# Altium project PFC_Stage.PrjPcb (part 3 of 3)

## Sheet Edge_Card_Interface.SchDoc
size A2; DocumentNumber: 9; SheetNumber: 9; SheetTotal: 10
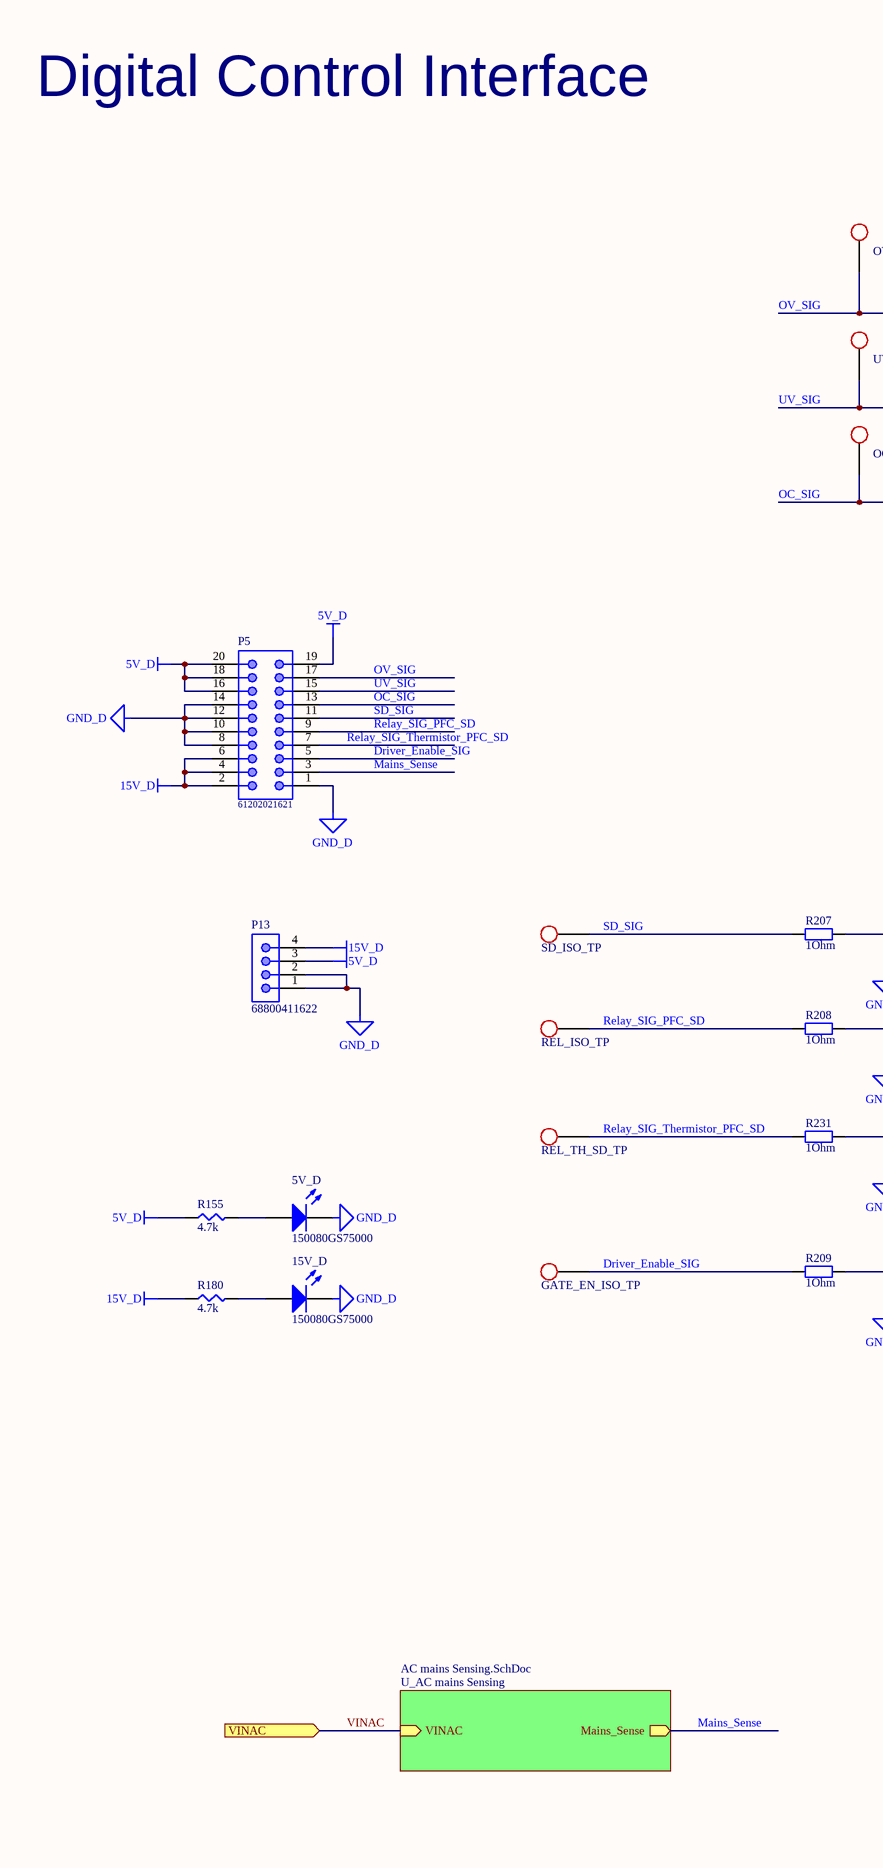
[diagram p11: Edge_Card_Interface.SchDoc, left]
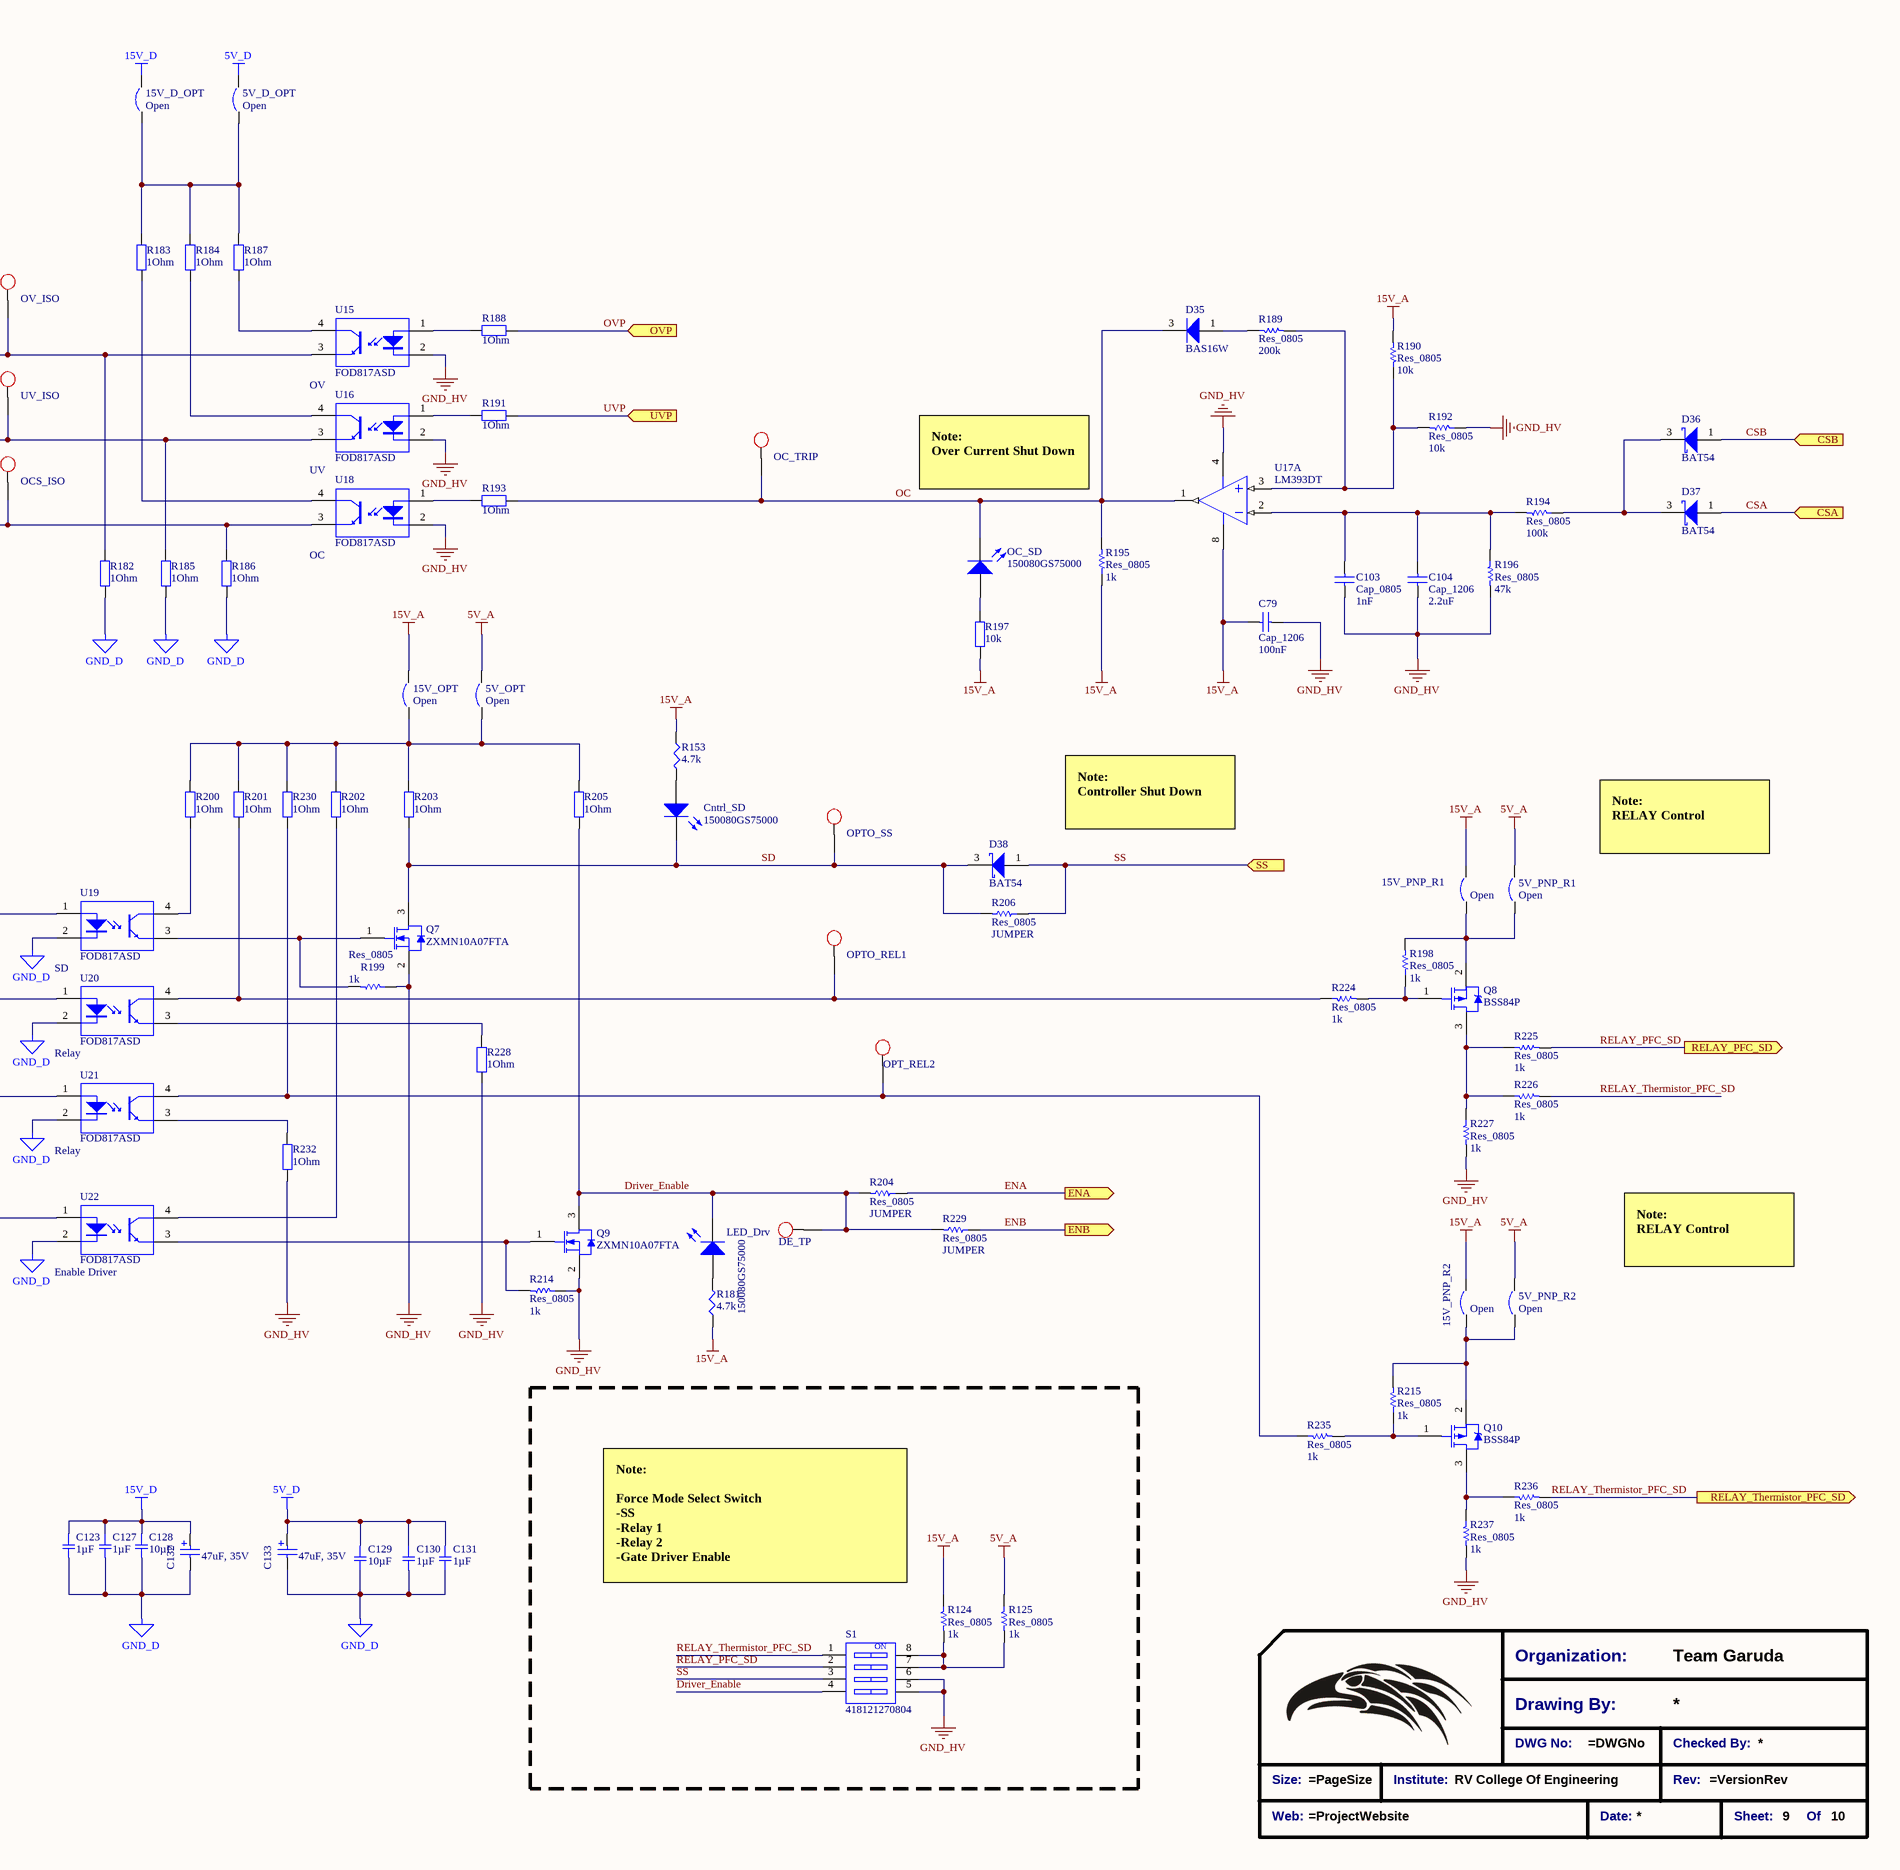
[diagram p12: Edge_Card_Interface.SchDoc, right]

### Parts
(Parts that share a designator on the sheet are numbered #1, #2 ... from top to bottom, then left to right.)
5V_D  150080GS75000  [0805_A]
5V_D_OPT  Open  [Solder Bridge - HP]  (no BOM)
5V_OPT  Open  [Solder Bridge - HP]  (no BOM)
5V_PNP_R1  Open  [Solder Bridge - HP - SQ]  (no BOM)
5V_PNP_R2  Open  [Solder Bridge - HP - SQ]  (no BOM)
15V_D  150080GS75000  [0805_A]
15V_D_OPT  Open  [Solder Bridge - HP]  (no BOM)
15V_OPT  Open  [Solder Bridge - HP]  (no BOM)
15V_PNP_R1  Open  [Solder Bridge - HP - SQ]  (no BOM)
15V_PNP_R2  Open  [Solder Bridge - HP - SQ]  (no BOM)
*?#4  Title_Block  (value not drawn)  (graphical)
C79  Cap_1206  value 100nF  [SMD-1206C]
C103  Cap_0805  Size: 1nF  [SMD-0805C]
C104  Cap_1206  value 2.2uF  [SMD-1206C]
C123  1µF  [SMD-0805C]
C127  1µF  [SMD-0805C]
C128  10µF  [SMD-1206C]
C129  10µF  [SMD-1206C]
C130  1µF  [SMD-0805C]
C131  1µF  [SMD-0805C]
C132  47uF, 35V  [WCAP-ASLU_6.3x7.7]
C133  47uF, 35V  [WCAP-ASLU_6.3x7.7]
Cntrl_SD  150080GS75000  [0805_A]
D35  BAS16W  [SOT95P278X110-3N]
D36  BAT54  [SOT95P278X110-3N]
D37  BAT54  [SOT95P278X110-3N]
D38  BAT54  [SOT95P278X110-3N]
DE_TP  Test Point  [Test_point_SMD]  (value not drawn)  (no BOM)
GATE_EN_ISO_TP  Test Point  [Test_point_SMD]  (value not drawn)  (no BOM)
LED_Drv  150080GS75000  [0805_A]
OC_SD  150080GS75000  [0805_A]
OC_TRIP  Test Point  [Test_point_SMD]  (value not drawn)  (no BOM)
OCS_ISO  Test Point  [Test_point_SMD]  (value not drawn)  (no BOM)
OPT_REL2  Test Point  [Test_point_SMD]  (value not drawn)  (no BOM)
OPTO_REL1  Test Point  [Test_point_SMD]  (value not drawn)  (no BOM)
OPTO_SS  Test Point  [Test_point_SMD]  (value not drawn)  (no BOM)
OV_ISO  Test Point  [Test_point_SMD]  (value not drawn)  (no BOM)
P5  61202021621  [61202021621]
P13  68800411622  [68800411622]
Q7  ZXMN10A07FTA  [DIOD-SOT23-3_D_V]
Q8  BSS84P  [SOT95P278X110-3N]
Q9  ZXMN10A07FTA  [DIOD-SOT23-3_D_V]
Q10  BSS84P  [SOT95P278X110-3N]
R124  Res_0805  value 1k  [WRIS-KSKE_0805_H=0.6mm]
R125  Res_0805  value 1k  [WRIS-KSKE_0805_H=0.6mm]
R153#2  4.7k  [SMD-0805-RES]
R155#2  4.7k  [SMD-0805-RES]
R180  4.7k  [SMD-0805-RES]
R181  4.7k  [SMD-0805-RES]
R182  1Ohm  [WRIS-KSKE_0805_H=0.6mm]
R183  1Ohm  [WRIS-KSKE_0805_H=0.6mm]
R184  1Ohm  [WRIS-KSKE_0805_H=0.6mm]
R185  1Ohm  [WRIS-KSKE_0805_H=0.6mm]
R186  1Ohm  [WRIS-KSKE_0805_H=0.6mm]
R187  1Ohm  [WRIS-KSKE_0805_H=0.6mm]
R188  1Ohm  [WRIS-KSKE_0805_H=0.6mm]
R189  Res_0805  value 200k  [WRIS-KSKE_0805_H=0.6mm]
R190  Res_0805  value 10k  [WRIS-KSKE_0805_H=0.6mm]
R191  1Ohm  [WRIS-KSKE_0805_H=0.6mm]
R192  Res_0805  value 10k  [WRIS-KSKE_0805_H=0.6mm]
R193  1Ohm  [WRIS-KSKE_0805_H=0.6mm]
R194  Res_0805  value 100k  [WRIS-KSKE_0805_H=0.6mm]
R195  Res_0805  value 1k  [WRIS-KSKE_0805_H=0.6mm]
R196  Res_0805  value 47k  [WRIS-KSKE_0805_H=0.6mm]
R197  10k  [WRIS-KSKE_0805_H=0.6mm]
R198  Res_0805  value 1k  [WRIS-KSKE_0805_H=0.6mm]
R199  Res_0805  value 1k  [WRIS-KSKE_0805_H=0.6mm]
R200  1Ohm  [WRIS-KSKE_0805_H=0.6mm]
R201  1Ohm  [WRIS-KSKE_0805_H=0.6mm]
R202  1Ohm  [WRIS-KSKE_0805_H=0.6mm]
R203  1Ohm  [WRIS-KSKE_0805_H=0.6mm]
R204  Res_0805  value JUMPER  [WRIS-KSKE_0805_H=0.6mm]
R205  1Ohm  [WRIS-KSKE_0805_H=0.6mm]
R206  Res_0805  value JUMPER  [WRIS-KSKE_0805_H=0.6mm]
R207  1Ohm  [WRIS-KSKE_0805_H=0.6mm]
R208  1Ohm  [WRIS-KSKE_0805_H=0.6mm]
R209  1Ohm  [WRIS-KSKE_0805_H=0.6mm]
R214#2  Res_0805  value 1k  [WRIS-KSKE_0805_H=0.6mm]
R215#2  Res_0805  value 1k  [WRIS-KSKE_0805_H=0.6mm]
R224  Res_0805  value 1k  [WRIS-KSKE_0805_H=0.6mm]
R225  Res_0805  value 1k  [WRIS-KSKE_0805_H=0.6mm]
R226  Res_0805  value 1k  [WRIS-KSKE_0805_H=0.6mm]
R227  Res_0805  value 1k  [WRIS-KSKE_0805_H=0.6mm]
R228  1Ohm  [WRIS-KSKE_0805_H=0.6mm]
R229  Res_0805  value JUMPER  [WRIS-KSKE_0805_H=0.6mm]
R230  1Ohm  [WRIS-KSKE_0805_H=0.6mm]
R231  1Ohm  [WRIS-KSKE_0805_H=0.6mm]
R232  1Ohm  [WRIS-KSKE_0805_H=0.6mm]
R235  Res_0805  value 1k  [WRIS-KSKE_0805_H=0.6mm]
R236  Res_0805  value 1k  [WRIS-KSKE_0805_H=0.6mm]
R237  Res_0805  value 1k  [WRIS-KSKE_0805_H=0.6mm]
REL_ISO_TP  Test Point  [Test_point_SMD]  (value not drawn)  (no BOM)
REL_TH_SD_TP  Test Point  [Test_point_SMD]  (value not drawn)  (no BOM)
S1  418121270804  [418121270804]
SD_ISO_TP  Test Point  [Test_point_SMD]  (value not drawn)  (no BOM)
U15  FOD817ASD  Signal: OV  [FAIR-MDIP-4_V]
U16  FOD817ASD  Signal: UV  [FAIR-MDIP-4_V]
U17  LM393DT  [SOIC127P570X175_HS-9N - No Thermal]  (part A of 2)
U18  FOD817ASD  Signal: OC  [FAIR-MDIP-4_V]
U19  FOD817ASD  Signal: SD  [FAIR-MDIP-4_V]
U20  FOD817ASD  Signal: Relay  [FAIR-MDIP-4_V]
U21  FOD817ASD  Signal: Relay  [FAIR-MDIP-4_V]
U22  FOD817ASD  Signal: Enable Driver  [FAIR-MDIP-4_V]
UV_ISO  Test Point  [Test_point_SMD]  (value not drawn)  (no BOM)

### Sub-sheets
U_AC mains Sensing = AC mains Sensing.SchDoc: VINAC (in), Mains_Sense (out)

### Ports
CSA (in), CSB (in), ENA (out), ENB (out), OVP (in), RELAY_PFC_SD (out), RELAY_Thermistor_PFC_SD (out), SS (in), UVP (in), VINAC (in)

### Nets
5V_A: 5V_OPT.2 5V_PNP_R1.2 5V_PNP_R2.2 R125.1
5V_D: 5V_D_OPT.2 C129.1 C130.1 C131.1 C133.2(P) P5.16 P5.18 P5.19 P5.20 P13.3 R155#2.1
15V_A: 15V_OPT.2 15V_PNP_R1.2 15V_PNP_R2.2 C79.1 R124.1 R153#2.1 R181.1 R190.2 R195.1 R197.1 U17.8(VCC+)
15V_D: 15V_D_OPT.2 C123.1 C127.1 C128.1 C132.2(P) P5.2 P5.4 P5.6 P13.4 R180.1
GND_D: 5V_D.1(K) 15V_D.1(K) C123.2 C127.2 C128.2 C129.2 C130.2 C131.2 C132.1(N) C133.1(N) P5.1 P5.8 P5.10 P5.12 P5.14 P13.1 P13.2 R182.1 R185.1 R186.2 U19.2(CATHODE) U20.2(CATHODE) U21.2(CATHODE) U22.2(CATHODE)
GND_HV: C79.2 C103.1 C104.2 Q7.2(S) Q9.2(S) R192.1 R196.2 R199.1 R214#2.1 R227.2 R228.1 R232.1 R237.2 S1.5 S1.6 U15.2(CATHODE) U16.2(CATHODE) U17.4(VCC-) U18.2(CATHODE)
CSA: D37.1(A) ; port CSA
CSB: D36.1(A) ; port CSB
Driver_Enable: DE_TP.1 LED_Drv.1(K) Q9.3(D) R204.2 R205.1 R229.2 S1.4  [project net Driver_Enable_9]
Driver_Enable_SIG: GATE_EN_ISO_TP.1 P5.5 R209.2  [project net Driver_Enable_SIG_9]
ENA: R204.1 ; port ENA
ENB: R229.1 ; port ENB
Mains_Sense: P5.3 ; sheet U_AC mains Sensing/Mains_Sense
OC: D35.3(K) OC_SD.1(K) OC_TRIP.1 R193.1 R195.2 U17.1(OUT1)  [project net OC_9]
OC_SIG: OCS_ISO.1 P5.13 R186.1 U18.3(EMITTER)  [project net OC_SIG_9]
OV_SIG: OV_ISO.1 P5.17 R182.2 U15.3(EMITTER)  [project net OV_SIG_9]
OVP: R188.1 ; port OVP
RELAY_PFC_SD: R225.2 S1.2 ; port RELAY_PFC_SD
Relay_SIG_PFC_SD: P5.9 R208.2 REL_ISO_TP.1  [project net Relay_SIG_PFC_SD_9]
Relay_SIG_Thermistor_PFC_SD: P5.7 R231.2 REL_TH_SD_TP.1  [project net Relay_SIG_Thermistor_PFC_SD_9]
RELAY_Thermistor_PFC_SD: R226.2 R236.2 S1.1 ; port RELAY_Thermistor_PFC_SD
SD: Cntrl_SD.1(K) D38.3(K) OPTO_SS.1 Q7.3(D) R203.1 R206.2  [project net SD_9]
SD_SIG: P5.11 R207.2 SD_ISO_TP.1  [project net SD_SIG_9]
SS: D38.1(A) R206.1 S1.3 ; port SS
UV_SIG: P5.15 R185.2 U16.3(EMITTER) UV_ISO.1  [project net UV_SIG_9]
UVP: R191.1 ; port UVP
VINAC: port VINAC, sheet U_AC mains Sensing/VINAC
Net5V_D_2: 5V_D.2(A) R155#2.2
Net5V_D_OPT_1: 5V_D_OPT.1 15V_D_OPT.1 R183.2 R184.2 R187.1
Net5V_OPT_1: 5V_OPT.1 15V_OPT.1 R200.2 R201.2 R202.2 R203.2 R205.2 R230.2
Net5V_PNP_R1_1: 5V_PNP_R1.1 15V_PNP_R1.1 Q8.2(SOURCE) R198.2
Net5V_PNP_R2_1: 5V_PNP_R2.1 15V_PNP_R2.1 Q10.2(SOURCE) R215#2.2
Net15V_D_2: 15V_D.2(A) R180.2
NetC103_2: C103.2 C104.1 R194.2 R196.1 U17.2(IN1-)
NetCntrl_SD_2: Cntrl_SD.2(A) R153#2.2
NetD35_1: D35.1(A) R189.1
NetD36_3: D36.3(K) D37.3(K) R194.1
NetLED_Drv_2: LED_Drv.2(A) R181.2
NetOC_SD_2: OC_SD.2(A) R197.2
NetOPT_REL2_1: OPT_REL2.1 R230.1 R235.1 U21.4(COLLECTOR)
NetOPTO_REL1_1: OPTO_REL1.1 R201.1 R224.1 U20.4(COLLECTOR)
NetQ7_1: Q7.1(G) R199.2 U19.3(EMITTER)
NetQ8_1: Q8.1(GATE) R198.1 R224.2
NetQ8_3: Q8.3(DRAIN) R225.1 R226.1 R227.1
NetQ9_1: Q9.1(G) R214#2.2 U22.3(EMITTER)
NetQ10_1: Q10.1(GATE) R215#2.1 R235.2
NetQ10_3: Q10.3(DRAIN) R236.1 R237.1
NetR124_2: R124.2 R125.2 S1.7 S1.8
NetR183_1: R183.1 U18.4(COLLECTOR)
NetR184_1: R184.1 U16.4(COLLECTOR)
NetR187_2: R187.2 U15.4(COLLECTOR)
NetR188_2: R188.2 U15.1(ANODE)
NetR189_2: R189.2 R190.1 R192.2 U17.3(IN1+)
NetR191_2: R191.2 U16.1(ANODE)
NetR193_2: R193.2 U18.1(ANODE)
NetR200_1: R200.1 U19.4(COLLECTOR)
NetR202_1: R202.1 U22.4(COLLECTOR)
NetR207_1: R207.1 U19.1(ANODE)
NetR208_1: R208.1 U20.1(ANODE)
NetR209_1: R209.1 U22.1(ANODE)
NetR228_2: R228.2 U20.3(EMITTER)
NetR231_1: R231.1 U21.1(ANODE)
NetR232_2: R232.2 U21.3(EMITTER)

### Notes on the sheet
- Digital Control Interface
- Note:                                                                                  Over Current Shut Down
- Note:                                                                                Controller Shut Down
- Note:                                                                                 RELAY Control
- (near R124) Note:
  Force Mode Select Switch
  -SS
  -Relay 1
  -Relay 2
  -Gate Driver Enable
- (in symbol 418121270804) ON
- (in symbol Title_Block) Organization:; Team Garuda; Drawing By:; DWG No:; Checked By:; Size:; Institute:; RV College Of Engineering; Rev:; Web:; Date:; Sheet:; Of

### Library data of the parts
5V_D 15V_D Cntrl_SD LED_Drv OC_SD = 150080GS75000: SMD mono-color Chip LED, WL-SMCW, Green; PackageReference: 0805_A; Color: Green; PartNumber: 150080GS75000; ComponentLink1Description: Manufacturer URL; ComponentLink1URL: http://www.we-online.com; ComponentLink2Description: Datasheet; ComponentLink2URL: http://katalog.we-online.com/led/datasheet/150080GS75000.pdf
5V_D_OPT 5V_OPT 5V_PNP_R1 5V_PNP_R2 15V_D_OPT 15V_OPT 15V_PNP_R1 15V_PNP_R2 = Solder Bridge: Circuit Breaker; Published: 24-Mar-1999; Revision: July-2002: Re-released for DXP Platform.; Publisher: Altium Limited
*?#4 = Title_Block: Standard Title Block
C79 C104 = Cap: Capacitor; Published: 8-Jun-2000; LatestRevisionDate: 17-Jul-2002; LatestRevisionNote: Re-released for DXP Platform.; PackageReference: RAD-0.3; Publisher: Altium Limited; PackageDescription: Radial Cap, Thru-Hole; 2 Leads; 0.3 in Pin Spacing
C103 = Cap: Capacitor; Value: 100pF; Published: 8-Jun-2000; LatestRevisionDate: 17-Jul-2002; LatestRevisionNote: Re-released for DXP Platform.; PackageReference: RAD-0.3; Publisher: Altium Limited; PackageDescription: Radial Cap, Thru-Hole; 2 Leads; 0.3 in Pin Spacing
C123 C127 C130 C131 = GRM219R61H105KA73D: CAP CER 1UF 50V X5R 0805; Manufacturer: Murata Electronics North America; Factory Stock: 0; Unit Price (USD): 0.19; Minimum Quantity: 1; Tolerance: ±10%; Datasheets: http://www.murata.com/~/media/webrenewal/support/library/catalog/products/capacitor/mlcc/c02e.pdf; Image: //media.digikey.com/Renders/Murata%20Renders/0805%20(2012%20Metric)%20.85mm.jpg; Digi-Key Part Number: 490-10743-1-ND; Part Number: GRM219R61H105KA73D; Quantity Available: 3572; @ qty: 0; Packaging: Cut Tape (CT); Series: GRM; Part Status: Active; Value: 1µF; Voltage: 50V; Temperature Coefficient: X5R; Operating Temperature: -55°C ~ 85°C; Features: -; Ratings: -; Applications: General Purpose; Mounting Type: Surface Mount, MLCC; Package / Case: 0805 (2012 Metric); Size / Dimension: 0.079" L x 0.049" W (2.00mm x 1.25mm); Height - Seated (Max): -; Thickness (Max): 0.037" (0.95mm); Lead Spacing: -; Lead Style: -
C128 C129 = GCJ31CR71A106KA13L: CAP CER 10UF 10V X7R 1206; Manufacturer: Murata Electronics North America; Factory Stock: 0; Unit Price (USD): 0.71; Minimum Quantity: 1; Tolerance: ±10%; Datasheets: http://www.murata.com/~/media/webrenewal/support/library/catalog/products/capacitor/mlcc/c03e.ashx; Image: //media.digikey.com/Renders/Murata%20Renders/GR331BD72E473KW01L.jpg; Digi-Key Part Number: 490-5848-1-ND; Part Number: GCJ31CR71A106KA13L; Quantity Available: 33084; @ qty: 0; Packaging: Cut Tape (CT); Series: GCJ; Part Status: Active; Value: 10µF; Voltage: 10V; Temperature Coefficient: X7R; Operating Temperature: -55°C ~ 125°C; Features: Soft Termination; Ratings: AEC-Q200; Applications: Automotive, Boardflex Sensitive; Mounting Type: Surface Mount, MLCC; Package / Case: 1206 (3216 Metric); Size / Dimension: 0.126" L x 0.063" W (3.20mm x 1.60mm); Height - Seated (Max): -; Thickness (Max): 0.063" (1.60mm); Lead Spacing: -; Lead Style: -
C132 C133 = 865090545008: WCAP-ASLU Aluminium Electrolytic Capacitors, D6.3mm x L7.7mm, 47uF, +/-20%, 35VDC; Dissipation Factor: 14%; Leakage Current: 3.29uA; Endurance: 1000h; Technical Reference: ASBD077470M035DVCTCA000; Ripple Current max.: 75mA; ComponentLink1Description: Manufacturer; ComponentLink1URL: http://www.we-online.de; ComponentLink2Description: Datasheet; ComponentLink2URL: https://katalog.we-online.com/pbs/datasheet/865090545008.pdf; Mounting Technology: SMD; Operating Temperature: -40 to +85degC; Packaging: Tape and Reel; Part Number: 865090545008; Publisher: Wurth Elektronik; Capacitance: 47uF; Diameter: 6.3mm; Length: 7.7mm; Published Date: August 2019; Rated Voltage: 35VDC; Capacitance Tolerance: +/-20%
D35 = BAS16: Silicon Switching Diode, SOT323, Reel, Green; Manufacturer: Infineon; IR (max): 100Â nA; Configuration: Single; VBR (min): 85Â V; VR (max): 80Â V; trr (max): 4Â ns; Green: TRUE; VF (max): 1.25Â V; IF (max): 250Â mA; Mounting Technology: Surface Mount; PackageReference: SOT323; ComponentLink2URL: http://www.infineon.com/dgdl/bas16series.pdf?folderId=db3a30431400ef6801141b5844e103ea&fileId=db3a30431400ef6801141b93811b03ff; Halogen-free: TRUE; ComponentLink2Description: Datasheet; PartNumber: BAS16W; ComponentLink1Description: Manufacturer URL; ComponentLink3URL: http://www.infineon.com/dgdl/SOT323-Package_Overview.pdf?folderId=db3a30431936bc4b0119533e1dcb3c92&fileId=db3a30431936bc4b011953495f283cb1; ComponentLink1URL: http://www.infineon.com/; PackageDescription: 3-Pin Small Outline Transistor Package, 1.25 x 2 mm Body, 0.65 mm Pitch; ComponentLink3Description: Package Specification
D36-D38 = BAT54: Silicon Switching Diode, SOT323, Reel, Green; PartNumber: BAS16W; Manufacturer: Infineon; IR (max): 100Â nA; Configuration: Single; VBR (min): 85Â V; VR (max): 80Â V; trr (max): 4Â ns; Green: TRUE; VF (max): 1.25Â V; IF (max): 250Â mA; Mounting Technology: Surface Mount; PackageReference: SOT323; ComponentLink2URL: http://www.infineon.com/dgdl/bas16series.pdf?folderId=db3a30431400ef6801141b5844e103ea&fileId=db3a30431400ef6801141b93811b03ff; Halogen-free: TRUE; ComponentLink2Description: Datasheet; ComponentLink1Description: Manufacturer URL; ComponentLink3URL: http://www.infineon.com/dgdl/SOT323-Package_Overview.pdf?folderId=db3a30431936bc4b0119533e1dcb3c92&fileId=db3a30431936bc4b011953495f283cb1; ComponentLink1URL: http://www.infineon.com/; PackageDescription: 3-Pin Small Outline Transistor Package, 1.25 x 2 mm Body, 0.65 mm Pitch; ComponentLink3Description: Package Specification
DE_TP GATE_EN_ISO_TP OC_TRIP OCS_ISO OPT_REL2 OPTO_REL1 OPTO_SS OV_ISO REL_ISO_TP REL_TH_SD_TP SD_ISO_TP UV_ISO = Test Point: TP
P5 = 61202021621: Male Box Header WR-BHD, THT, Vertical, pitch 2.54 mm, 20 pins; Pitch: 2.54 mm; Working Voltage: 250 VAC; Withstanding Voltage: 500 VAC; Contact Resistance: 20 mOhm; Pin Number: 20; ComponentLink1Description: Manufacturer; ComponentLink1URL: http://www.we-online.de; ComponentLink2Description: Datasheet; ComponentLink2URL: https://katalog.we-online.de/em/datasheet/6120xx21621.pdf; Part Number: 61202021621; Published Date: August 2018; Publisher: Wurth Elektronik; Operating Temperature: -40 to 125 degC; Packaging: Tray; Gender: Male; Mounting Technology: THT; Orientation: Vertical
P13 = 68800411622: WR-WTB “J” Type THT Vertical Male Shrouded Header, pitch 2.5mm, 4p; Pin Number: 4; Contact Resistance: 20mOhm; Rated Current: 3A; Withstanding Voltage: 800VAC; Working Voltage: 250VAC; ComponentLink1Description: Manufacturer; ComponentLink1URL: http://www.we-online.de; ComponentLink2Description: Datasheet; ComponentLink2URL: https://www.we-online.com/catalog/datasheet/68800411622.pdf; Pitch: 2.5mm; Published Date: January 2020; Publisher: Wurth Elektronik; Mounting Technology: THT; Packaging: Bag; Operating Temperature: -25 to +85degC; Part Number: 68800411622; Gender: Male; Type: Vertical
Q7 Q9 = CMP-2000-07433-1: N-Channel Enhancement Mode MOSFET, 100 V, -55 to 150 degC, 3-Pin SOT23, RoHS, Tape and Reel; Manufacturer: Diodes Inc; Drain-to-Source Voltage [Vdss]: 100V; Qg Gate Charge: 2.9nC; Rated Power Dissipation: 625mW; Drain-Source On Resistance-Max: 0.7O; Package Description: 3-Pin Small Outline Transistor, Body 2.9 x 1.3 mm, Pitch 0.96 mm; Channel Type: N-Channel; Mounting Technology: SurfaceMount; Datasheet Version: Rev. 6-2, 08/2012; Manufacturer URL: http://www.diodes.com/; Datasheet URL: http://www.diodes.com/_files/datasheets/ZXMN10A07F.pdf; Package Reference: SOT23-3
Q8 Q10 = CMP-1099-00028-1: P-Channel SIPMOS Small-Signal-Transistor, -60 V VDS, -0.17 A ID, -55 to 150 degC, PG-SOT23, Reel, Green; Manufacturer: Infineon; VGS(th) (max): -2Â V; VGS(th) (min): -1Â V; VDS (max): -60Â V; Rth: 350Â K/W; Pto t (max): 0.36Â W; ID (max): -0.17Â A; IDpuls (max): -0.68Â A; RDS (on) (max) (@4.5V): 12,000Â mOhm; QG: 1Â nC; Green: TRUE; RDS (on) (max): 8,000Â mOhm; ComponentLink3URL: http://www.infineon.com/dgdl/SOT23-Package_Overview.pdf?folderId=db3a30431936bc4b0119532290053c66&fileId=db3a30431936bc4b0119533468123c85; ComponentLink3Description: Package Specification; Packing: Reel; PartNumber: BSS84P; ComponentLink2Description: Datasheet; Mounting Technology: Surface Mount; ComponentLink2URL: http://www.infineon.com/dgdl/BSS84P_Rev2.7%5B1%5D.pdf?folderId=db3a304314dca38901154a72e3951a65&fileId=db3a304330f68606013118ac7a9b4549; PackageReference: PG-SOT23; ComponentLink1URL: http://www.infineon.com/; PackageVersion: Apr-08; ComponentLink1Description: Manufacturer URL; PackageDescription: 3-Pin Small Outline Transistor Package, 2.9 x 1.3 mm Body, 0.95 mm Pitch; Halogen-free: TRUE; DatasheetVersion: Rev. 2.7
R124 R125 R189 R190 R192 R194-R196 R198 R199 R204 R206 R214#2 R215#2 R224-R227 R229 R235-R237 = Res1: Resistor; Published: 8-Jun-2000; LatestRevisionDate: 17-Jul-2002; LatestRevisionNote: Re-released for DXP Platform.; PackageReference: AXIAL-0.3; Publisher: Altium Limited; PackageDescription: Axial Device, Thru-Hole; 2 Leads; 0.3 in Pin Spacing
R153#2 R155#2 R180 R181 = ERJ-6ENF4701V: RES SMD 4.7K OHM 1% 1/8W 0805; Manufacturer: Panasonic Electronic Components; Factory Stock: 0; Unit Price (USD): 0.00729; @ qty: 1500; Minimum Quantity: 1; Power (Watts): 0.125W, 1/8W; Temperature Coefficient: ±100ppm/°C; Part Number: ERJ-6ENF4701V; Datasheets: http://industrial.panasonic.com/www-cgi/jvcr13pz.cgi?E+PZ+3+AOA0002+ERJ6ENF4701V+7+WW; Image: //media.digikey.com/Renders/Panasonic%20Renders/ERJ-0805%20Pkg.jpg; Digi-Key Part Number: P4.70KCCT-ND; Quantity Available: 312387; Packaging: Cut Tape (CT); Series: ERJ; Part Status: Active; Value: 4.7k; Tolerance: ±1%; Composition: Thick Film; Features: Automotive AEC-Q200; Operating Temperature: -55°C ~ 155°C; Package / Case: 0805 (2012 Metric); Supplier Device Package: 0805; Size / Dimension: 0.079" L x 0.049" W (2.00mm x 1.25mm); Height - Seated (Max): 0.028" (0.70mm); Number of Terminations: 2; Failure Rate: -
R182-R188 R191 R193 R200-R203 R205 R207-R209 R228 R230-R232 = 560050320011: WRIS-KSKE Thick Film Resistors, size 0805, 1Ohm, +/-1%, 0.33W; Rated Current: 0.57A; Temperature Coefficient of Resistance: +/-100ppm/degC; Technical Reference: KE08051R00F103KAATP0000; ComponentLink1Description: Manufacturer; ComponentLink1URL: http://www.we-online.de; ComponentLink2Description: Datasheet; ComponentLink2URL: https://katalog.we-online.com/pbs/datasheet/560050320011.pdf; Publisher: Wurth Elektronik; Rated Power: 0.33W; Resistance: 1Ohm; Mounting Technology: SMT; Height: 0.6mm; Part Number: 560050320011; Packaging: Tape and Reel; Published Date: September 2019; Size: 0805; Length: 2mm; Operating Temperature: -55 to +155degC; Resistance Tolerance: +/-1%; Width: 1.25mm
R197 = 560050320001: WRIS-KSKE Thick Film Resistors, size 0805, 0.1Ohm, +/-1%, 0.33W; Rated Current: 1.81A; Temperature Coefficient of Resistance: 250ppm/degC; Technical Reference: KE0805R100F103LAATP0000; ComponentLink1Description: Manufacturer; ComponentLink1URL: http://www.we-online.de; ComponentLink2Description: Datasheet; ComponentLink2URL: https://katalog.we-online.com/pbs/datasheet/560050320001.pdf; Publisher: Wurth Elektronik; Rated Power: 0.33W; Resistance: 0.1Ohm; Mounting Technology: SMT; Height: 0.6mm; Part Number: 560050320001; Packaging: Tape and Reel; Published Date: September 2019; Size: 0805; Length: 2mm; Operating Temperature: -55 to +155degC; Resistance Tolerance: +/-1%; Width: 1.25mm
S1 = 418121270804: WS-DISV Small Compact SMT Dip Switch, Raised Actuator, pitch 2.54mm, 4p; Operation Force: 600g; Pole Number: 4; Actuator Type: Raise Type; Circuit: SPST-NO; Rated Current Switching: 25mA; Rated Current Non-Switching: 100mA; Rated Voltage Non-Switching: 50VDC; Rated Voltage Switching: 24VDC; ComponentLink1Description: Manufacturer; ComponentLink1URL: http://www.we-online.de; ComponentLink2Description: Datasheet; ComponentLink2URL: https://katalog.we-online.com/em/datasheet/418121270804.pdf; Pitch: 2.54mm; Contact Material: Copper Alloy; Mounting Technology: SMT; Operating Temperature: -40 to +85degC; Contact Plating: Gold; Packaging: Tape and Reel; Part Number: 418121270804; Publisher: Wurth Elektronik; Published Date: September 2019
U15 U16 U18-U22 = CMP-2000-06279-1: Phototransistor Optocoupler, 4 us Rise, 3 us Fall, 5000 Vrms, -55 to 110 degC, 4-Pin MDIP, RoHS, Tape and Reel; Manufacturer: Fairchild Semiconductor; Maximum Input Current: 50mA; Maximum Forward Voltage: 1.4V; Maximum Reverse Voltage: 6V; Product Width: 7mm(Max); Input Type: DC; Maximum Current Transfer Ratio: 160%; Maximum Rise Time: 18us; Typical Rise Time: 4us; Typical Forward Voltage: 1.2V; Product Length: 5.1mm(Max); Package Version: 10/2014; Maximum Collector Emitter Saturation Voltage: 200mV; Number of Channels per Chip: 1; Product Height: 4mm(Max); Maximum Power Dissipation: 200mW; Typical Fall Time: 3us; Maximum Collector Emitter Voltage: 70V; Pin_Count: 4; Minimum Current Transfer Ratio: 80%; Output Device: Transistor; Manufacturer URL: https://www.fairchildsemi.com/; Family: FOD817; Supplier_Package: PDIPSMDBlack; Datasheet URL: https://www.fairchildsemi.com/datasheets/FO/FOD817.pdf; Package Description: 4-Pin Surface Mount Device, Body 6.5 x 4.6 mm, Pitch 2.54 mm; Mounting Technology: SurfaceMount; Package Reference: MDIP 4L; Maximum Operating Temperature: 110C; Mounting: SurfaceMount; Maximum Fall Time: 18us; Package URL: https://www.fairchildsemi.com/package-drawings/N0/N04C.pdf; Product Type: TransistorandPhotovoltaicOutputPhotoCouplers; Datasheet Version: Rev. 2.8, 11/2015; Minimum Operating Temperature: -55C; Maximum Collector Current: 50mA; Packaging: TapeandReel; Minimum Isolation Voltage: 5000Vrms; Output Type: DC
U17 = CMP-2000-06550-1: Low-Power, Dual-Voltage Comparator, 2 to 36 V, 0 to 70 degC, 8-Pin SOIC (SO), RoHS, Tape and Reel; Manufacturer: STMicroelectronics; Voltage - Supply, Single/Dual (±): 2V~36V,±1V~18V; Current - Input Bias (Max): 0.25µA@5V; Number of Elements: 2; Current - Output (Typ): 18mA@5V; Other Names: 497-1593-2; Voltage - Input Offset (Max): 5mV@30V; Output Type: CMOS,DTL,ECL,MOS,Open-Collector,TTL; EDA / CAD Models: DownloadfromAcceleratedDesigns; Other Related Documents: LM393ViewAllSpecificationsLM393ViewAllSpecifications; Online Catalog: Comparators-2elements; Current - Quiescent (Max): 2.5mA; Standard Package: 2,500; Manufacturer URL: http://www.st.com/; Package Description: 8-Pin Small Outline Integrated Circuit, Body 4.9 x 3.9 mm, Pitch 1.27 mm; Packaging: Tape&Reel(TR); Datasheet Version: Rev. 15, 02/2016; Category: IntegratedCircuits(ICs); Operating Temperature: 0°C~70°C; Mounting Type: SurfaceMount; Supplier Device Package: 8-SO; Datasheet URL: http://www.st.com/content/ccc/resource/technical/document/datasheet/group1/b4/cc/cf/13/18/28/44/f5/CD00000465/files/CD00000465.pdf/jcr:content/translations/en.CD00000465.pdf; Family: Linear-Comparators; Mounting Technology: SurfaceMount; Type: GeneralPurpose; Package Reference: SO-8; Package / Case: 8-SOIC(0.154",3.90mmWidth)

## Sheet AC mains Sensing.SchDoc
size A3
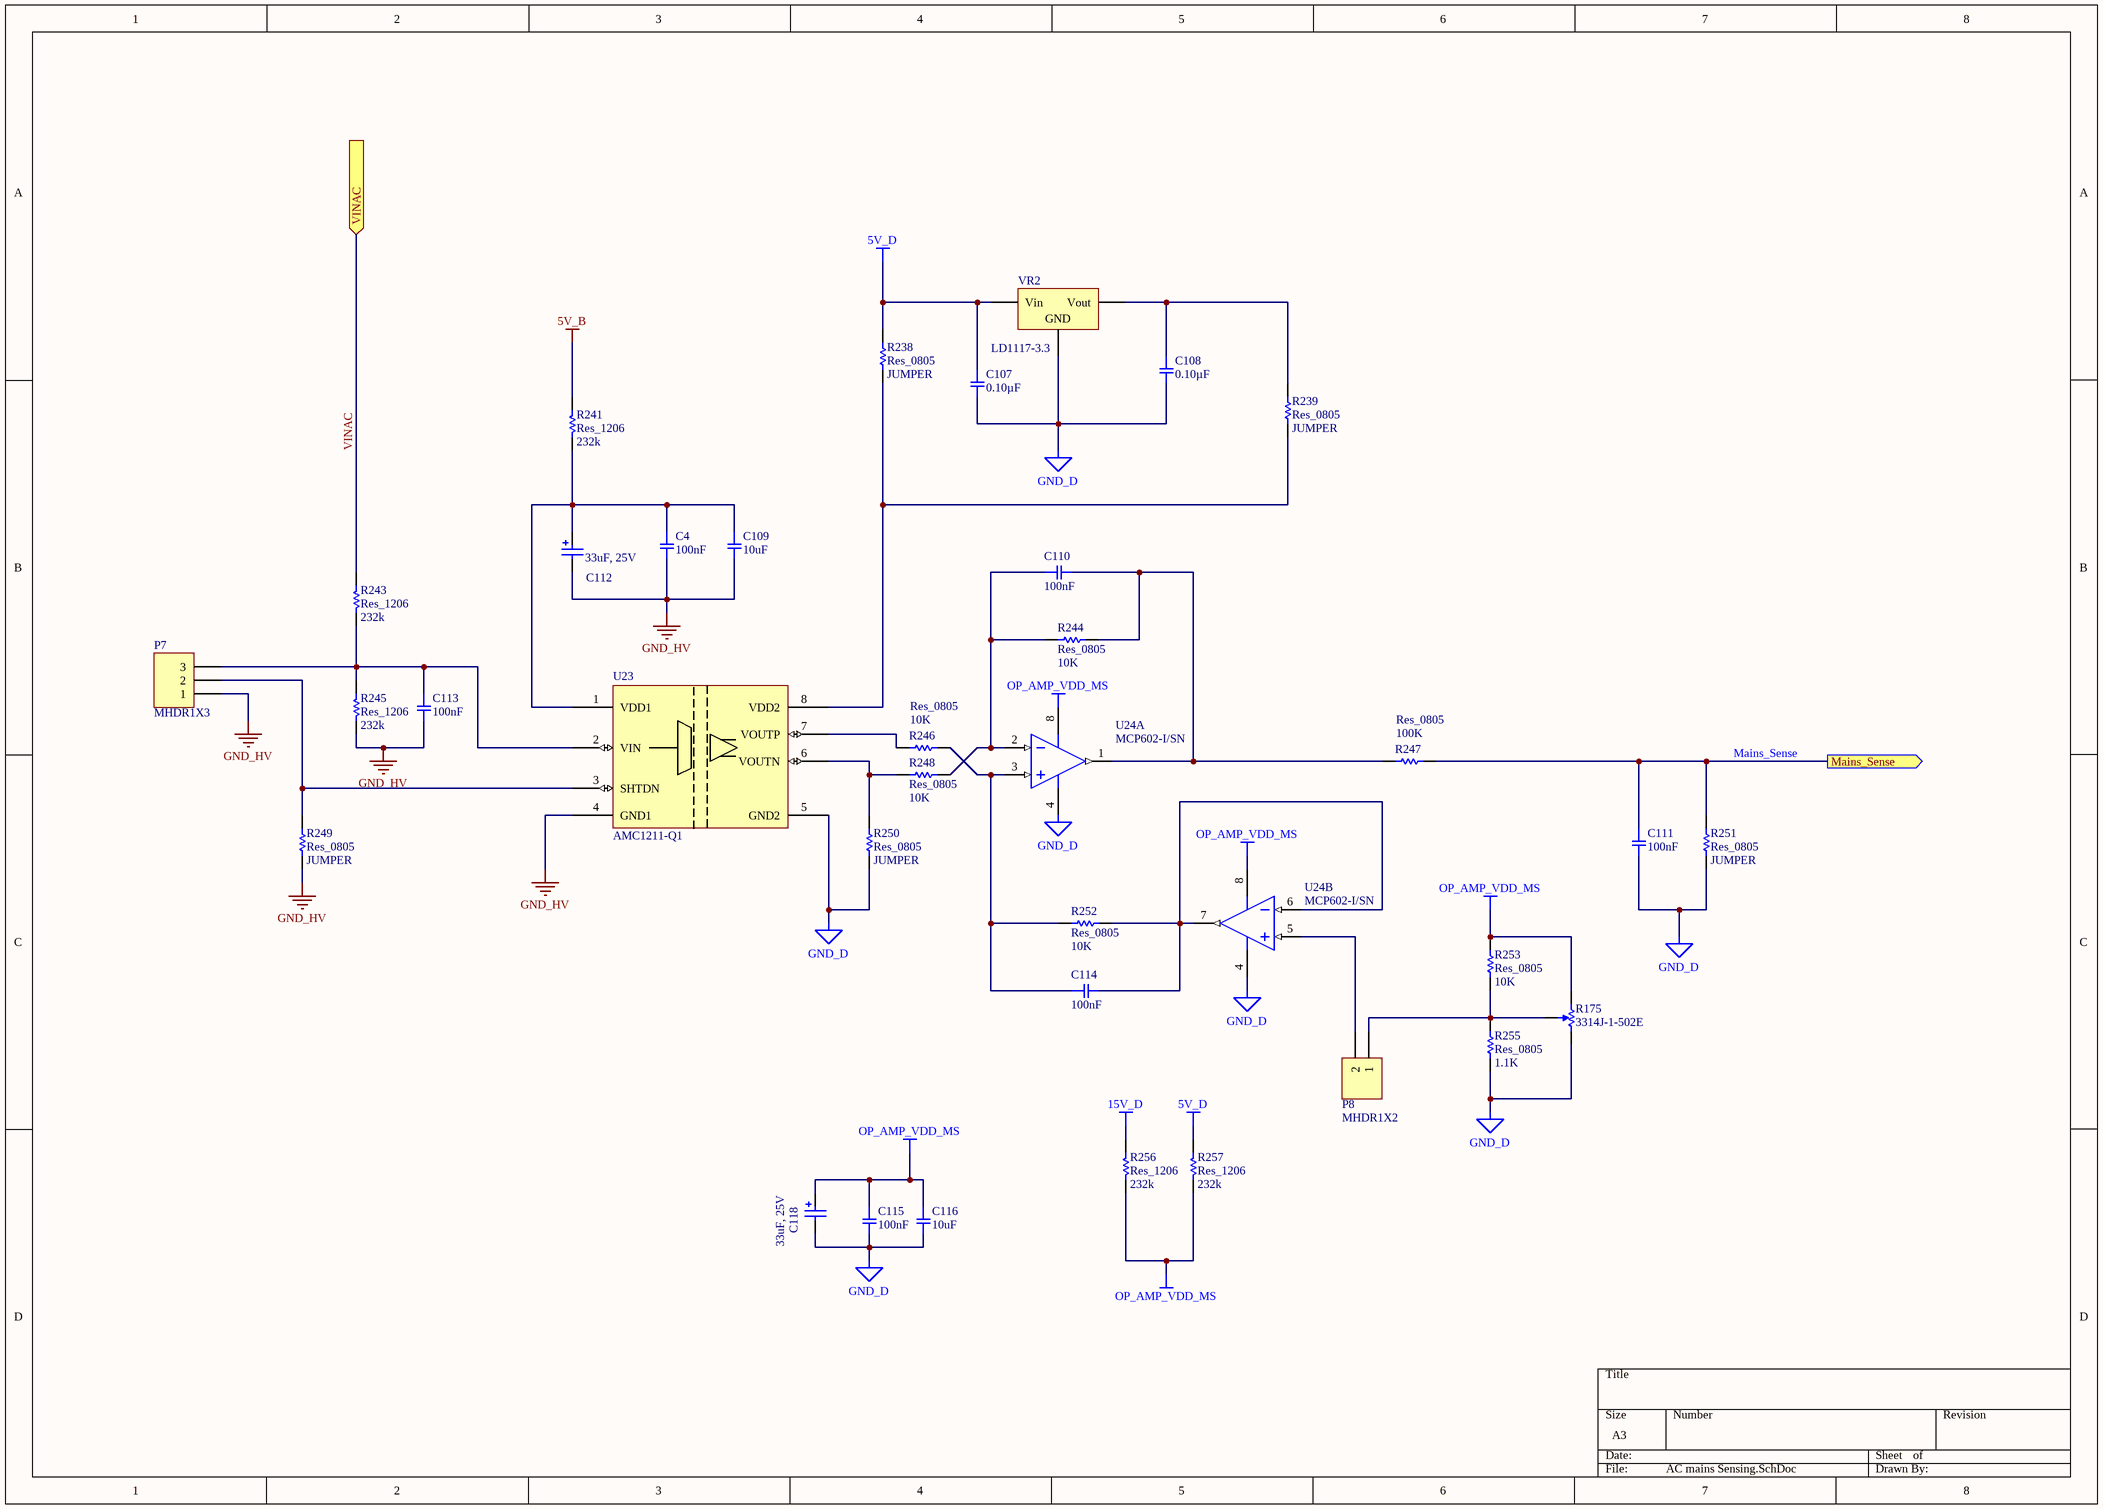
[diagram p13: AC mains Sensing.SchDoc]

### Parts
C4  100nF  [SMD-0805C]
C107  0.10µF  [SMD-0805C]
C108  0.10µF  [SMD-0805C]
C109  10uF  [SMD-0805C]
C110  100nF  [SMD-0805C]
C111  100nF  [SMD-0805C]
C112  33uF, 25V  [WCAP-ASLL_6.3x5.5]
C113  100nF  [SMD-0805C]
C114  100nF  [SMD-0805C]
C115  100nF  [SMD-0805C]
C116  10uF  [SMD-0805C]
C118  33uF, 25V  [WCAP-ASLL_6.3x5.5]
P7  MHDR1X3  [MHDR1X3]
P8  MHDR1X2  [61900211121]
R175  3314J-1-502E  [BOUR-3314J-1_V]
R238  Res_0805  value JUMPER  [WRIS-KSKE_0805_H=0.6mm]
R239  Res_0805  value JUMPER  [WRIS-KSKE_0805_H=0.6mm]
R241  Res_1206  value 232k  [WRIS-KSKE_1206_H=0.6mm]
R243  Res_1206  value 232k  [WRIS-KSKE_1206_H=0.6mm]
R244  Res_0805  value 10K  [WRIS-KSKE_0805_H=0.6mm]
R245  Res_1206  value 232k  [WRIS-KSKE_1206_H=0.6mm]
R246  Res_0805  value 10K  [WRIS-KSKE_0805_H=0.6mm]
R247  Res_0805  value 100K  [WRIS-KSKE_0805_H=0.6mm]
R248  Res_0805  value 10K  [WRIS-KSKE_0805_H=0.6mm]
R249  Res_0805  value JUMPER  [WRIS-KSKE_0805_H=0.6mm]
R250  Res_0805  value JUMPER  [WRIS-KSKE_0805_H=0.6mm]
R251  Res_0805  value JUMPER  [WRIS-KSKE_0805_H=0.6mm]
R252  Res_0805  value 10K  [WRIS-KSKE_0805_H=0.6mm]
R253  Res_0805  value 10K  [WRIS-KSKE_0805_H=0.6mm]
R255  Res_0805  value 1.1K  [WRIS-KSKE_0805_H=0.6mm]
R256  Res_1206  value 232k  [WRIS-KSKE_1206_H=0.6mm]
R257  Res_1206  value 232k  [WRIS-KSKE_1206_H=0.6mm]
U23  AMC1211-Q1  [SOIC127P570X175_HS-9N - No Thermal]
U24  MCP602-I/SN  [SOIC127P570X175_HS-9N - No Thermal]  (parts A,B of 2)
VR2  LD1117-3.3  [SOT230P700X180-4N]

### Ports
Mains_Sense (out), VINAC (in)

### Nets
5V_B: R241.2
5V_D: C107.1 R238.1 R257.2 VR2.3(Vin)
15V_D: R256.2
GND_D: C107.2 C108.2 C111.2 C115.2 C116.2 C118.1(N) R175.3 R250.2 R251.2 R255.2 U23.5(GND2) U24.4(VSS) VR2.1(GND)
GND_HV: C4.2 C109.2 C112.1(N) C113.2 P7.1 R245.1 R249.2 U23.4(GND1)
OP_AMP_VDD_MS: C115.1 C116.1 C118.2(P) R175.1 R253.1 R256.1 R257.1 U24.8(VDD)
Mains_Sense: C111.1 R247.2 R251.1 ; port Mains_Sense
VINAC: R243.2 ; port VINAC
NetC4_1: C4.1 C109.1 C112.2(P) R241.1 U23.1(VDD1)
NetC108_1: C108.1 R239.1 VR2.2(Vout)
NetC110_1: C110.1 R244.1 R248.2 U24.2(VINA-)
NetC110_2: C110.2 R244.2 R247.1 U24.1(VOUTA)
NetC113_1: C113.1 P7.3 R243.1 R245.2 U23.2(VIN)
NetC114_1: C114.1 R246.2 R252.1 U24.3(VINA+)
NetC114_2: C114.2 R252.2 U24.6(VINB-) U24.7(VOUTB)
NetP7_2: P7.2 R249.1 U23.3(SHTDN)
NetP8_1: P8.1 R175.2 R253.2 R255.1
NetP8_2: P8.2 U24.5(VINB+)
NetR238_2: R238.2 R239.2 U23.8(VDD2)
NetR246_1: R246.1 U23.7(VOUTP)
NetR248_1: R248.1 R250.1 U23.6(VOUTN)

### Library data of the parts
C4 C109-C111 C113-C116 = GC321AD72E103KX01D: CAP CER 10000PF 250V X7T 0805; Manufacturer: Murata Electronics North America; Factory Stock: 0; Unit Price (USD): 0.3; Minimum Quantity: 1; Tolerance: ±10%; Datasheets: http://search.murata.co.jp/Ceramy/image/img/A01X/G101/ENG/GC321AD72E103KX01-01.pdf; Image: //media.digikey.com/Renders/Murata%20Renders/0805(GC3)200x125.jpg; Digi-Key Part Number: 490-13986-1-ND; Part Number: GC321AD72E103KX01D; Quantity Available: 4000; @ qty: 0; Packaging: Cut Tape (CT); Series: GC3; Part Status: Active; Voltage: 250V; Temperature Coefficient: X7T; Operating Temperature: -55°C ~ 125°C; Features: -; Ratings: AEC-Q200; Applications: Automotive; Mounting Type: Surface Mount, MLCC; Package / Case: 0805 (2012 Metric); Size / Dimension: 0.079" L x 0.049" W (2.00mm x 1.25mm); Height - Seated (Max): -; Thickness (Max): 0.039" (1.00mm); Lead Spacing: -; Lead Style: -
  C4 C110 C111 C113-C115: Value: 100nF
  C109 C116: Value: 10uF
C107 C108 = GCD21BR71H104KA01L: CAP CER 0.1UF 50V X7R 0805; Manufacturer: Murata Electronics North America; Factory Stock: 0; Unit Price (USD): 0.24; Minimum Quantity: 1; Tolerance: ±10%; Datasheets: http://www.murata.com/~/media/webrenewal/support/library/catalog/products/capacitor/mlcc/c03e.ashx; Image: //media.digikey.com/Renders/Murata%20Renders/0805%28GxM6%29.jpg; Digi-Key Part Number: 490-11955-1-ND; Part Number: GCD21BR71H104KA01L; Quantity Available: 157; @ qty: 0; Packaging: Cut Tape (CT); Series: GCD; Part Status: Active; Value: 0.10µF; Voltage: 50V; Temperature Coefficient: X7R; Operating Temperature: -55°C ~ 125°C; Features: -; Ratings: AEC-Q200; Applications: Automotive; Mounting Type: Surface Mount, MLCC; Package / Case: 0805 (2012 Metric); Size / Dimension: 0.079" L x 0.049" W (2.00mm x 1.25mm); Height - Seated (Max): -; Thickness (Max): 0.049" (1.25mm); Lead Spacing: -; Lead Style: -
C112 C118 = 865060443003: WCAP-ASLL SMT Aluminum Electrolytic Capacitors, D6.3mm x L5.5mm, 33uF, +/-20%, 25VDC; Dissipation Factor: 14%; Endurance: 2000h; Leakage Current: 8.25uA; Ripple Current max.: 230mA; Technical Reference: ASED055330M025DVCTBB000; ComponentLink1Description: Manufacturer; ComponentLink1URL: http://www.we-online.de; ComponentLink2Description: Datasheet; ComponentLink2URL: https://katalog.we-online.com/pbs/datasheet/865060443003.pdf; Length: 5.5mm; Mounting Technology: SMT; Operating Temperature: -55 to +105degC; Packaging: Tape and Reel; Published Date: August 2019; Capacitance: 33uF; Diameter: 6.3mm; Part Number: 865060443003; Publisher: Wurth Elektronik; Capacitance Tolerance: +/-20%; Rated Voltage: 25VDC
P7 = MHDR1X3: Header, 3-Pin; LatestRevisionDate: 17-Jul-2002; LatestRevisionNote: Re-released for DXP Platform.; Publisher: Altium Limited
P8 = MHDR1X2: Header, 2-Pin; LatestRevisionDate: 17-Jul-2002; LatestRevisionNote: Re-released for DXP Platform.; Publisher: Altium Limited
R175 = CMP-2000-05590-1: 4 mm Square Trimpot(R) Trimming Potentiometer, 5 KOhm, +/- 20%, 0.25 W, -55 to 125 degC, 3-Pin SMD, RoHS, Tape and Reel; Manufacturer: Bourns; Power: 250; Angle of rotation: 240°; Resistance: 5; Curve: linear; Package Description: 3-Pin Surface Mount Device, Body 4.5 x 4.5 mm, Pitch 1.15 mm; Mounting Technology: SurfaceMount; Package Reference: 3314J-1; Package: J-lead; Manufacturer URL: http://www.bourns.com/; Datasheet Version: 05/2016; Tolerance: ±20%; Temperature range: -55...+125°C; Datasheet URL: http://www.bourns.com/docs/Product-Datasheets/3314.pdf
R238 R239 R241 R243-R253 R255-R257 = Res1: Resistor; Published: 8-Jun-2000; LatestRevisionDate: 17-Jul-2002; LatestRevisionNote: Re-released for DXP Platform.; PackageReference: AXIAL-0.3; Publisher: Altium Limited; PackageDescription: Axial Device, Thru-Hole; 2 Leads; 0.3 in Pin Spacing
U24 = MCP602_2: 2.7V to 6.0V Single Supply CMOS Operational Amplifier, 8-Pin SOIC, Industrial Temperature; ComponentLink1URL: http://www.microchip.com/; ComponentLink1Description: Manufacturer URL; RevisionNote: URLs added.; PackageReference: SOIC-SN8; ComponentLink2URL: http://ww1.microchip.com/downloads/en/DeviceDoc/21314g.pdf; ComponentLink3URL: http://www.microchip.com/stellent/groups/techpub_sg/documents/packagingspec/en012702.pdf; PackageDescription: 8-Lead Plastic Small Outline (SN) - Narrow, 3.90mm Body [SOIC]; DatasheetVersion: revG, Dec-2007; ComponentLink2Description: Datasheet; ComponentLink3Description: Package Specification; Code_IPC: SOIC127P600-8; Code_JEDEC: MS-012; PackageVersion: revBB, Aug-2009
VR2 = LD117-3.3: Voltage Regulator; Published: 24-Mar-1999; LatestRevisionDate: 29-May-2009; LatestRevisionNote: IPC-7351 Footprint Added.; PackageReference: D2PAK; Publisher: Altium Limited; PackageDescription: 3-Pin Transistor Outline Package 2.54 mm Pitch, 15.1 mm Lead Span

## Nets that join several sheets
2.5V_A: Current_Sense_1 (R61.1 R64.2 R66.1), External_connector_Power (9 pins)
5V_A: Current_Sense_1 (C32.2 C33.2 U5.1), External_connector_Power (14 pins), Edge_Card_Interface (5V_OPT.2 5V_PNP_R1.2 5V_PNP_R2.2 R125.1)
5V_B: Shut_Down (R153#1.2), Current_Sense_2 (C47.2 C48.2 U8.1), EMC_Stage (R137#1.2 R216.1), AC mains Sensing (R241.2)
5V_D: Edge_Card_Interface (11 pins), AC mains Sensing (C107.1 R238.1 R257.2 VR2.3)
15V_A: Gate_Driver (10 pins), External_connector_Power (18 pins), Edge_Card_Interface (11 pins)
15V_B: UCC28070_Control (7 pins), Shut_Down (9 pins), EMC_Stage (C101.1 R179.1 U14.3)
15V_D: Edge_Card_Interface (10 pins), AC mains Sensing (R256.2)
-2.5V_A: Current_Sense_1 (R57.2 R68.1), External_connector_Power (-2.5V_OA.1 -2.5VCC.1 R117.2 SB1.2)
GND_D: Edge_Card_Interface (24 pins), AC mains Sensing (13 pins)
GND_HV: PFC_Stage (22 pins), UCC28070_Control (32 pins), Shut_Down (17 pins), Current_Sense_1 (11 pins), Current_Sense_2 (17 pins), Gate_Driver (14 pins), EMC_Stage (15 pins), External_connector_Power (41 pins), Edge_Card_Interface (19 pins), AC mains Sensing (8 pins)
OP_AMP_CS_VDD: Current_Sense_1 (6 pins), Current_Sense_2 (6 pins), External_connector_Power (5V_OA.2 15V_OA.2)
OP_AMP_CS_VSS: Current_Sense_1 (9 pins), Current_Sense_2 (R80.2 U6.4 U7.4), External_connector_Power (-2.5V_OA.2 GND_OA.2)
400V+: PFC_Stage (15 pins), External_connector_Power (12 pins)
CSA: UCC28070_Control (D10.3 R20.1 R23.2 R27.1), Shut_Down (D24.1), Current_Sense_1 (R55.1 R56.1), Edge_Card_Interface (D37.1)
CSB: UCC28070_Control (D9.3 R19.2 R22.1 R28.2), Shut_Down (D25.1), Current_Sense_2 (R82.1 R83.1), Edge_Card_Interface (D36.1)
ENA: Gate_Driver (R162.2), Edge_Card_Interface (R204.1)
ENB: Gate_Driver (R165.2), Edge_Card_Interface (R229.1)
GDA: UCC28070_Control (D11.3 R17.1 U1.14), Gate_Driver (R163.1)
GDB: UCC28070_Control (D8.3 R16.1 U1.17), Gate_Driver (R166.1)
HV_RC: PFC_Stage (6 pins), EMC_Stage (D16.1 D19.1 R99#2.2), External_connector_Power (P1.1 P1.2 P1.3 P1.4)
IMO_EN: UCC28070_Control (Q5.1 R21.1 R24.2), Shut_Down (D26.1)
Mains_Sense: Edge_Card_Interface (P5.3), AC mains Sensing (C111.1 R247.2 R251.1)
NetD2_3: PFC_Stage (D2.3 L1.2), Current_Sense_1 (U5.4)
NetD5_3: PFC_Stage (D5.3 L2.2), Current_Sense_2 (U8.4)
NetQ1_2: PFC_Stage (Q1.2 Q2.2), Current_Sense_1 (U5.5)
NetQ3_2: PFC_Stage (Q3.2 Q4.2), Current_Sense_2 (U8.5)
OUTA1: PFC_Stage (R2.1 R4.1), Gate_Driver (U2.7)
OUTA2: PFC_Stage (R1.1 R3.1), Gate_Driver (U2.5)
OUTB1: PFC_Stage (R11.1 R13.1), Gate_Driver (U13.7)
OUTB2: PFC_Stage (R10.1 R12.1), Gate_Driver (U13.5)
OVP: Shut_Down (5 pins), Edge_Card_Interface (R188.1)
RELAY_PFC_SD: EMC_Stage (R221.1), Edge_Card_Interface (R225.2 S1.2)
RELAY_Thermistor_PFC_SD: EMC_Stage (Q14.1 R218.2 R219.1), Edge_Card_Interface (R226.2 R236.2 S1.1)
SS: UCC28070_Control (C20.1 U1.18), Shut_Down (R161.1), Edge_Card_Interface (D38.1 R206.1 S1.3)
UVP: Shut_Down (5 pins), Edge_Card_Interface (R191.1)
VINAC: UCC28070_Control (R26.2), Shut_Down (R130.1 R136.1), EMC_Stage (R98.1 R101#1.1), AC mains Sensing (R243.2)
VREF: UCC28070_Control (C117.1 R32.1 R38.2 U1.13), Shut_Down (R129.2 R142.2 R143.1)
VSENSE: PFC_Stage (R9.1), UCC28070_Control (R30.2), EMC_Stage (R157.2)